# Altium schematic sheet H_bridge.SchDoc: H-Bridge
size A4; DocumentNumber: 4; Revision: v1; SheetNumber: 4; SheetTotal: 4
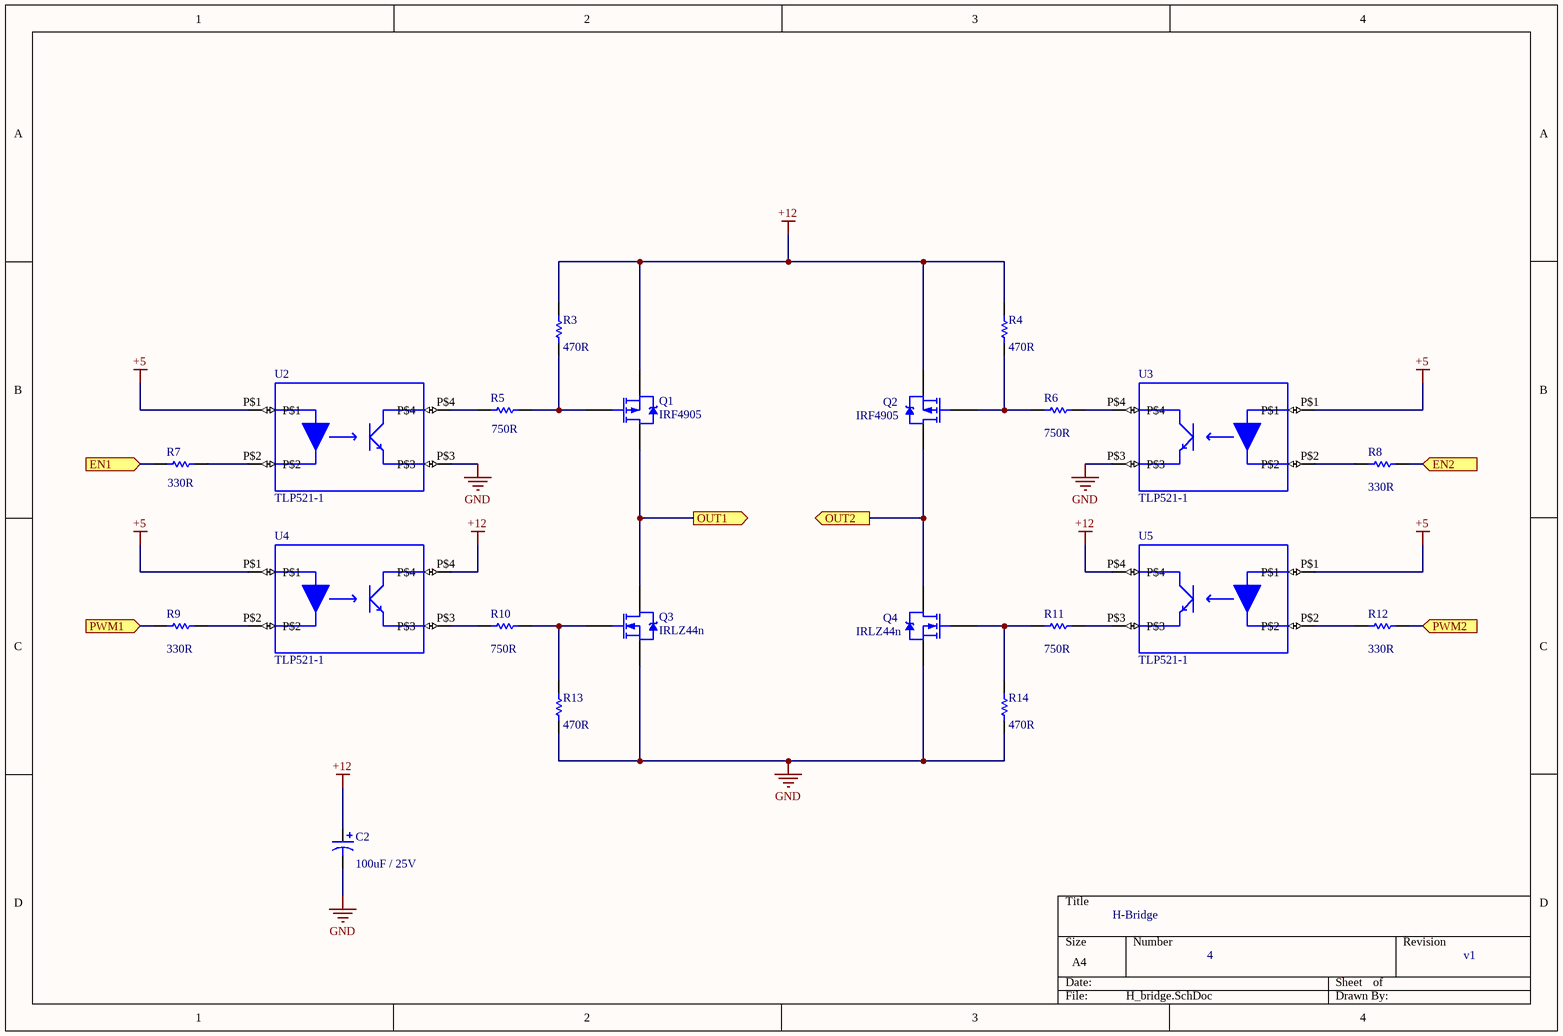
[diagram p0: H_bridge.SchDoc]

## Parts
C2  value 100uF / 25V  [RB7.6-15]  (hidden comment: Cap Pol1)
Q1  IRF4905  [TO-220AB]
Q2  IRF4905  [TO-220AB]
Q3  IRLZ44n  [TO-220AB]
Q4  IRLZ44n  [TO-220AB]
R3  value 470R  [AXIAL-0.3]  (hidden comment: Res1)
R4  value 470R  [AXIAL-0.3]  (hidden comment: Res1)
R5  value 750R  [AXIAL-0.3]  (hidden comment: Res1)
R6  value 750R  [AXIAL-0.3]  (hidden comment: Res1)
R7  value 330R  [AXIAL-0.3]  (hidden comment: Res1)
R8  value 330R  [AXIAL-0.3]  (hidden comment: Res1)
R9  value 330R  [AXIAL-0.3]  (hidden comment: Res1)
R10  value 750R  [AXIAL-0.3]  (hidden comment: Res1)
R11  value 750R  [AXIAL-0.3]  (hidden comment: Res1)
R12  value 330R  [AXIAL-0.3]  (hidden comment: Res1)
R13  value 470R  [AXIAL-0.3]  (hidden comment: Res1)
R14  value 470R  [AXIAL-0.3]  (hidden comment: Res1)
U2  TLP521-1  [TLP521-1]
U3  TLP521-1  [TLP521-1]
U4  TLP521-1  [TLP521-1]
U5  TLP521-1  [TLP521-1]

## Ports
EN1 (in), EN2 (in), OUT1 (out), OUT2 (out), PWM1 (in), PWM2 (in)

## Nets
+5: U2.P$1 U3.P$1 U4.P$1 U5.P$1
+12: C2.1 Q1.3(S) Q2.3(S) R3.2 R4.2 U4.P$4 U5.P$4
GND: C2.2 Q3.3(S) Q4.3(S) R13.2 R14.2 U2.P$3 U3.P$3
EN1: R7.1 ; port EN1
EN2: R8.1 ; port EN2
OUT1: Q1.2(D) Q3.2(D) ; port OUT1
OUT2: Q2.2(D) Q4.2(D) ; port OUT2
PWM1: R9.2 ; port PWM1
PWM2: R12.2 ; port PWM2
NetQ1_1: Q1.1(G) R3.1 R5.2
NetQ2_1: Q2.1(G) R4.1 R6.2
NetQ3_1: Q3.1(G) R10.1 R13.1
NetQ4_1: Q4.1(G) R11.1 R14.1
NetR5_1: R5.1 U2.P$4
NetR6_1: R6.1 U3.P$4
NetR7_2: R7.2 U2.P$2
NetR8_2: R8.2 U3.P$2
NetR9_1: R9.1 U4.P$2
NetR10_2: R10.2 U4.P$3
NetR11_2: R11.2 U5.P$3
NetR12_1: R12.1 U5.P$2

## Library data of the parts
C2 = Cap Pol1: Polarized Capacitor (Radial); Published: 8-Jun-2000; LatestRevisionDate: 17-Jul-2002; LatestRevisionNote: Re-released for DXP Platform.; PackageReference: RB7.6-15; Publisher: Altium Limited; PackageDescription: Polarized Capacitor (Radial); 2 Leads
Q1 Q2 = PMOS-2: P-Channel Power MOSFET; Note: Pin 4 not drawn and electrically connected to Pin 2.; Published: 8-Jun-2000; LatestRevisionDate: 17-Jul-2002; LatestRevisionNote: Re-released for DXP Platform.; DatasheetVersion: PD-9.390D; PackageVersion: Feb-1997; PackageReference: TO-220AB; Publisher: Altium Limited; PackageDescription: TO, Thru-Hole, Vertical, Heatsink Mounted; 3 In-Line Leads; Pitch 2.54 mm; ComponentLink1Description: Manufacturer Link; ComponentLink1URL: http://www.irf.com/
Q3 Q4 = NMOS-2: N-Channel Power MOSFET; Note: Pin 2 is electrically connected to pin 4.; Published: 8-Jun-2000; LatestRevisionDate: 17-Jul-2002; LatestRevisionNote: Re-released for DXP Platform.; DatasheetVersion: PD-9.814; PackageVersion: Feb-1997; PackageReference: TO-220AB; Publisher: Altium Limited; PackageDescription: TO, Thru-Hole, Vertical, Heatsink Mounted; 3 In-Line Leads; Pitch 2.54 mm; ComponentLink1Description: Manufacturer Link; ComponentLink1URL: http://www.irf.com/
R3-R14 = Res1: Resistor; Published: 8-Jun-2000; LatestRevisionDate: 17-Jul-2002; LatestRevisionNote: Re-released for DXP Platform.; PackageReference: AXIAL-0.3; Publisher: Altium Limited; PackageDescription: Axial Device, Thru-Hole; 2 Leads; 0.3 in Pin Spacing
U2-U5 = TLP521-1: ICM006; MF: Isocom; Package: None; Availability: Unavailable; SnapEDA_Link: https://www.snapeda.com/parts/TLP521-1/Isocom/view-part/918682/?ref=snap; MP: TLP521-1; Price: None; Value: *